# Altium schematic sheet ETHERNET.SchDoc
size A4; SheetNumber: 5; SheetTotal: 18
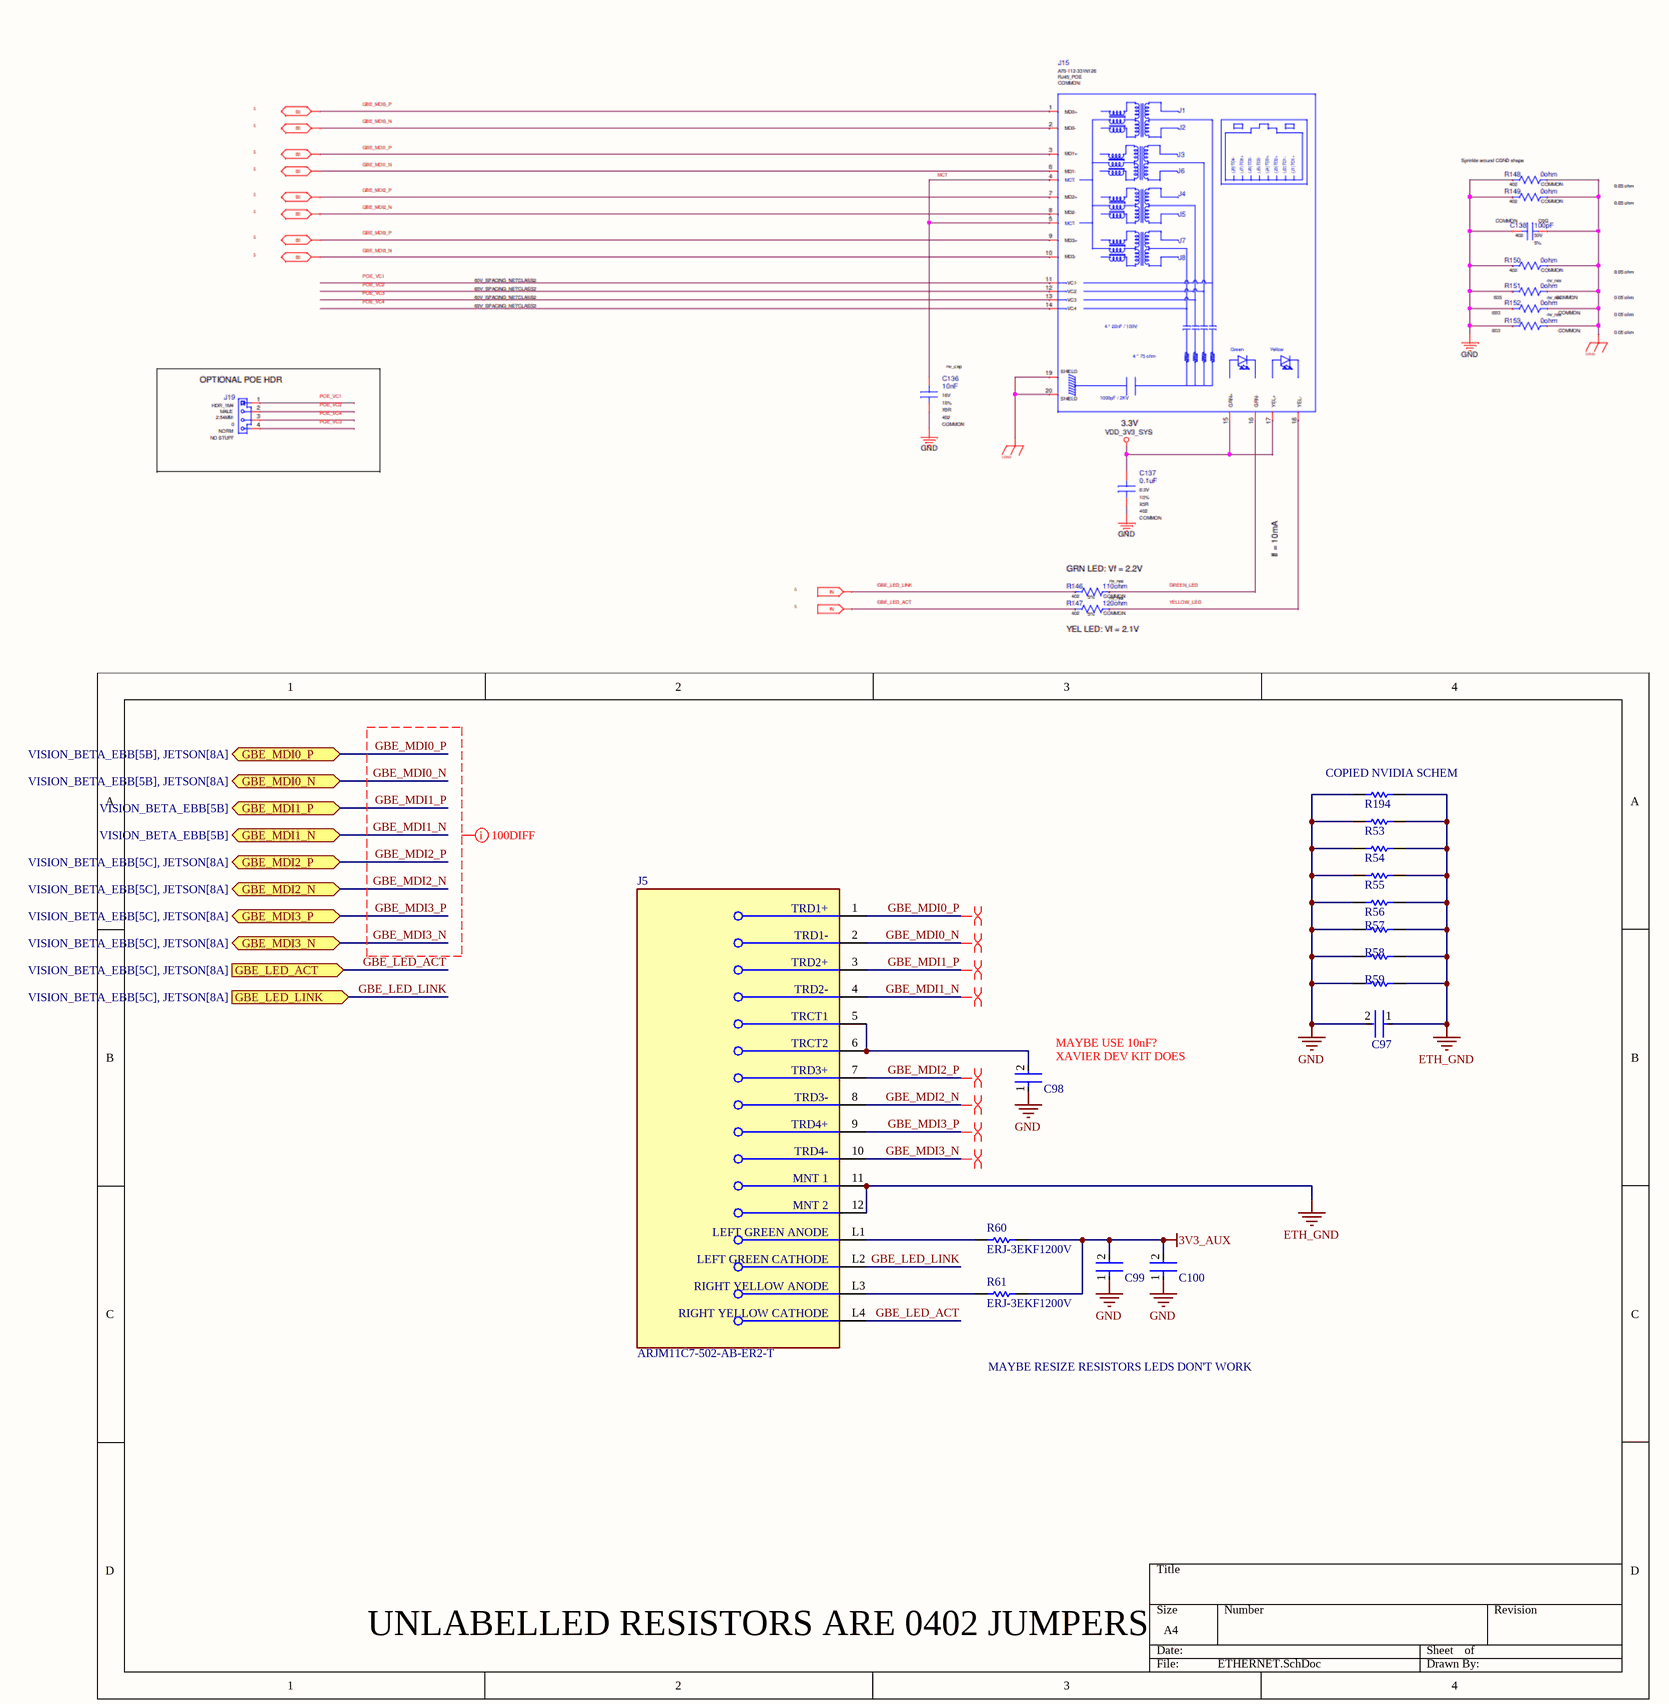
[diagram p0: ETHERNET.SchDoc]

## Parts
C97  C1005X7R1H104K050BB  [FP-C1005-050-0_05-IPC_C]  (value not drawn)
C98  C1005X7R1H104K050BB  [FP-C1005-050-0_05-IPC_C]  (value not drawn)
C99  C1005X7R1H104K050BB  [FP-C1005-050-0_05-IPC_C]  (value not drawn)
C100  C1005X7R1H104K050BB  [FP-C1005-050-0_05-IPC_C]  (value not drawn)
J5  ARJM11C7-502-AB-ER2-T  [FP-ARJM11C7-502-AB-ER2-T-MFG]
R53  0402 JUMPER  [RESC1005X40X25ML05T05]  (value not drawn)
R54  0402 JUMPER  [RESC1005X40X25ML05T05]  (value not drawn)
R55  0402 JUMPER  [RESC1005X40X25ML05T05]  (value not drawn)
R56  0402 JUMPER  [RESC1005X40X25ML05T05]  (value not drawn)
R57  0402 JUMPER  [RESC1005X40X25ML05T05]  (value not drawn)
R58  0402 JUMPER  [RESC1005X40X25ML05T05]  (value not drawn)
R59  0402 JUMPER  [RESC1005X40X25ML05T05]  (value not drawn)
R60  ERJ-3EKF1200V  [RESC1609X55X30ML15T15]
R61  ERJ-3EKF1200V  [RESC1609X55X30ML15T15]
R194  0402 JUMPER  [RESC1005X40X25ML05T05]  (value not drawn)

## Ports
GBE_LED_ACT (in, see VISION_BETA_EBB[5C], JETSON[8A]), GBE_LED_LINK (in, see VISION_BETA_EBB[5C], JETSON[8A]), GBE_MDI0_N (bidir, see VISION_BETA_EBB[5B], JETSON[8A]), GBE_MDI0_P (bidir, see VISION_BETA_EBB[5B], JETSON[8A]), GBE_MDI1_N (bidir, see VISION_BETA_EBB[5B]), GBE_MDI1_P (bidir, see VISION_BETA_EBB[5B]), GBE_MDI2_N (bidir, see VISION_BETA_EBB[5C], JETSON[8A]), GBE_MDI2_P (bidir, see VISION_BETA_EBB[5C], JETSON[8A]), GBE_MDI3_N (bidir, see VISION_BETA_EBB[5C], JETSON[8A]), GBE_MDI3_P (bidir, see VISION_BETA_EBB[5C], JETSON[8A])

## Nets
3V3_AUX: C99.2 C100.2 R60.2 R61.2
ETH_GND: C97.1 J5.11(MNT_1) J5.12(MNT_2) R53.2 R54.2 R55.2 R56.2 R57.2 R58.2 R59.2 R194.2
GND: C97.2 C98.1 C99.1 C100.1 R53.1 R54.1 R55.1 R56.1 R57.1 R58.1 R59.1 R194.1
GBE_LED_ACT: J5.L4(RIGHT_YELLOW_CATHODE) ; port GBE_LED_ACT
GBE_LED_LINK: J5.L2(LEFT_GREEN_CATHODE) ; port GBE_LED_LINK
GBE_MDI0_N: J5.2(TRD1-) ; port GBE_MDI0_N
GBE_MDI0_P: J5.1(TRD1+) ; port GBE_MDI0_P
GBE_MDI1_N: J5.4(TRD2-) ; port GBE_MDI1_N
GBE_MDI1_P: J5.3(TRD2+) ; port GBE_MDI1_P
GBE_MDI2_N: J5.8(TRD3-) ; port GBE_MDI2_N
GBE_MDI2_P: J5.7(TRD3+) ; port GBE_MDI2_P
GBE_MDI3_N: J5.10(TRD4-) ; port GBE_MDI3_N
GBE_MDI3_P: J5.9(TRD4+) ; port GBE_MDI3_P
NetC98_2: C98.2 J5.5(TRCT1) J5.6(TRCT2)
NetJ5_L1: J5.L1(LEFT_GREEN_ANODE) R60.1
NetJ5_L3: J5.L3(RIGHT_YELLOW_ANODE) R61.1

## Layout directives
differential pair: GBE_MDI0_N, GBE_MDI0_P, GBE_MDI1_N, GBE_MDI1_P, GBE_MDI2_N, GBE_MDI2_P, GBE_MDI3_N, GBE_MDI3_P
net class 100DIFF: GBE_MDI0_N, GBE_MDI0_P, GBE_MDI1_N, GBE_MDI1_P, GBE_MDI2_N, GBE_MDI2_P, GBE_MDI3_N, GBE_MDI3_P

## Notes on the sheet
- (near R194) COPIED NVIDIA SCHEM
- (near C98) MAYBE USE 10nF?
- (near C98) XAVIER DEV KIT DOES
- MAYBE RESIZE RESISTORS LEDS DON'T WORK
- UNLABELLED RESISTORS ARE 0402 JUMPERS

## Library data of the parts
C97-C100 = CMP-2000-05393-2: Multilayer Ceramic Capacitors 100nF ±10% 50V X7R SMD 0402; Voltage: 50V; Dielectric Material: Ceramic; Min Operating Temperature: -55°C; Depth: 0.5mm; Radiation Hardening: No; RoHS Compliant: Yes; Voltage Rating (DC): 50V; Lead Free: Lead Free; Resistor Type: Ceramic; Height: 0.5mm; Dielectric: X7R; Thickness: 0.022inch; Case/Package: 0402; Case Code (Metric): 1005; Termination: SMD/SMT; Capacitance: 100nF; Packaging: Tape and Reel; Max Operating Temperature: 125°C; Mount: Surface Mount; Package Quantity: 1; Width: 0.02inch; Weight: 2.3E-05oz; Voltage Rating: 50V; Tolerance: 10%; Construction: Flat; Case Code (Imperial): 0402; Length: 1mm; REACH SVHC: No SVHC; Series: C
J5 = CMP-27893-000001-1: RJ45 JACK W/MAG 1X1 1000BASE-T; Manufacturer: Abracon; Conn Gender: Female; Is Female: yes; Shielding: true; Pitch: 1.27mm; Number Of Contacts: 10; Conn Orientation: Right Angle; RoHS: TRUE; Digikey Description: RJ45 JACK W/MAG 1X1 1000BASE-T; Temperature Range Low: -40°C; ComponentLink2Description: Datasheet; Category: Conn; Temperature Range High: +85°C; Package: 0; Device Class L1: Connectors; Manufacturer Part Number: ARJM11C7-502-AB-ER2-T; ComponentLink2URL: https://abracon.com/Magnetics/ARJM11.pdf; Automotive: No; Contact Material: Gold; Height: 15.8mm; Lead Free: Yes; Temperature: -40°C to +85°C; Device Class L2: Modular / Ethernet Connectors; Device Class L3: unset; Octopart: https://octopart.com/arjm11c7-502-ab-er2-t-abracon-86945316
R53-R59 R194 = CMP-009-00118-2: READ THE NAME; Pins: 2; Component Type: Standard; Design Item ID: CMP-009-00206-2; Source: 0402jump.SchLib
R60 R61 = CMP-2000-00213-2: Chip Resistor, 120 Ohm, +/- 1%, 0.1 W, -55 to 155 degC, 0603 (1608 Metric), RoHS, Tape and Reel; Manufacturer: Panasonic; Power Rating: 100mW; Voltage Rating (DC): 75V; Resistance: 120Ohm; Temperature Coefficient: 100ppm/degreesC; Number of Terminations: 2; Military Standard: Not; Tolerance: 1%; Min Operating Temperature: -55degC; Packaging: TapeandReel; Lead Free: LeadFree; Max Operating Temperature: 155degC; Manufacturer URL: http://www.panasonic.com/; Case Code (Imperial): 0603; REACH SVHC: NoSVHC; Width: 0.031inch; Datasheet URL: https://industrial.panasonic.com/cdbs/www-data/pdf/RDA0000/AOA0000C283.pdf; RoHSCompliant: true; Max Power Dissipation: 100mW; Termination: SMD/SMT; Package Reference: 0603; Height: 0.022inch; Depth: 0.8mm; Package Description: 2-Pin Surface Mount Device, Body 1.6 x 0.85 mm; Contact Plating: Tin; Length: 1.6mm; Package URL: http://www.st.com/st-web-ui/static/active/en/resource/technical/document/datasheet/CD00001320.pdf; Radiation Hardening: No; Package Quantity: 1; Number of Pins: 2; Datasheet Version: 42095.0; Voltage Rating: 75V; Composition: ThickFilm; Case/Package: 0603; Mount: SurfaceMount; Case Code (Metric): 1608